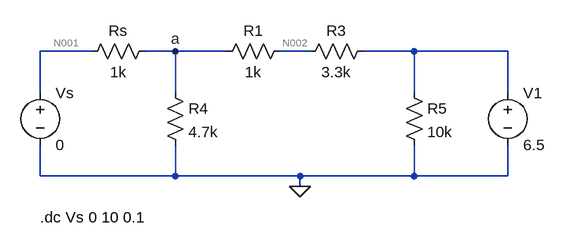
[diagram p0: schematic circuit3.asc]
circuit3.asc, the LTspice schematic file:
Version 4
SHEET 1 880 680
WIRE 112 48 32 48
WIRE 240 48 192 48
WIRE 320 48 240 48
WIRE 448 48 400 48
WIRE 608 48 528 48
WIRE 752 48 608 48
WIRE 32 112 32 48
WIRE 240 112 240 48
WIRE 608 112 608 48
WIRE 752 112 752 48
WIRE 32 240 32 192
WIRE 240 240 240 192
WIRE 240 240 32 240
WIRE 432 240 240 240
WIRE 608 240 608 192
WIRE 608 240 432 240
WIRE 752 240 752 192
WIRE 752 240 608 240
WIRE 432 256 432 240
FLAG 432 256 0
FLAG 240 48 a
SYMBOL voltage 32 96 R0
SYMATTR InstName Vs
SYMATTR Value 0
SYMBOL voltage 752 96 R0
SYMATTR InstName V1
SYMATTR Value 6.5
SYMBOL res 224 96 R0
SYMATTR InstName R4
SYMATTR Value 4.7k
SYMBOL res 592 96 R0
SYMATTR InstName R5
SYMATTR Value 10k
SYMBOL res 96 64 R270
WINDOW 0 32 56 VTop 2
WINDOW 3 0 56 VBottom 2
SYMATTR InstName Rs
SYMATTR Value 1k
SYMBOL res 304 64 R270
WINDOW 0 32 56 VTop 2
WINDOW 3 0 56 VBottom 2
SYMATTR InstName R1
SYMATTR Value 1k
SYMBOL res 432 64 R270
WINDOW 0 32 56 VTop 2
WINDOW 3 0 56 VBottom 2
SYMATTR InstName R3
SYMATTR Value 3.3k
TEXT 32 304 Left 2 !.dc Vs 0 10 0.1

The netlist it stands for:
* circuit3.asc
Vs N001 0 0
V1 N003 0 6.5
R4 a 0 4.7k
R5 N003 0 10k
Rs N001 a 1k
R1 a N002 1k
R3 N002 N003 3.3k
.dc Vs 0 10 0.1
.backanno
.end

* Results of the author's LTspice run, read from the files saved beside the schematic
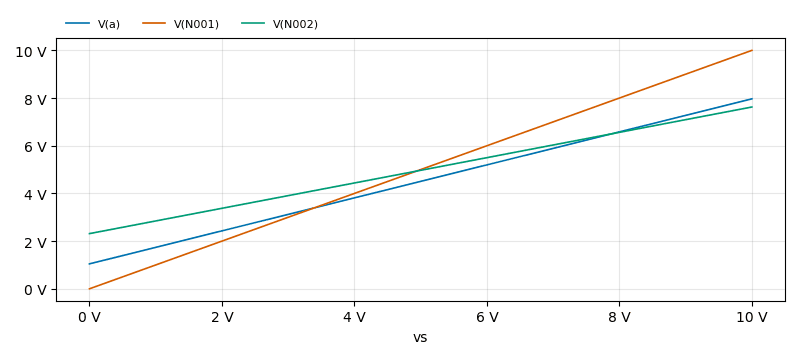
[diagram p1: DC transfer characteristic of circuit3.asc, plotted from the saved traces]
* DC transfer characteristic, 1 run:
*   V(a): 1.046 V at vs=0 V, 7.965 V at vs=10 V, min 1.046 V, max 7.965 V
*   V(N001): 0 V at vs=0 V, 10 V at vs=10 V, min 0 V, max 10 V
*   V(N002): 2.314 V at vs=0 V, 7.624 V at vs=10 V, min 2.314 V, max 7.624 V